# Altium schematic sheet INPUT.SchDoc: INPUT AND EMI FILTER
size 420 x 297 mm
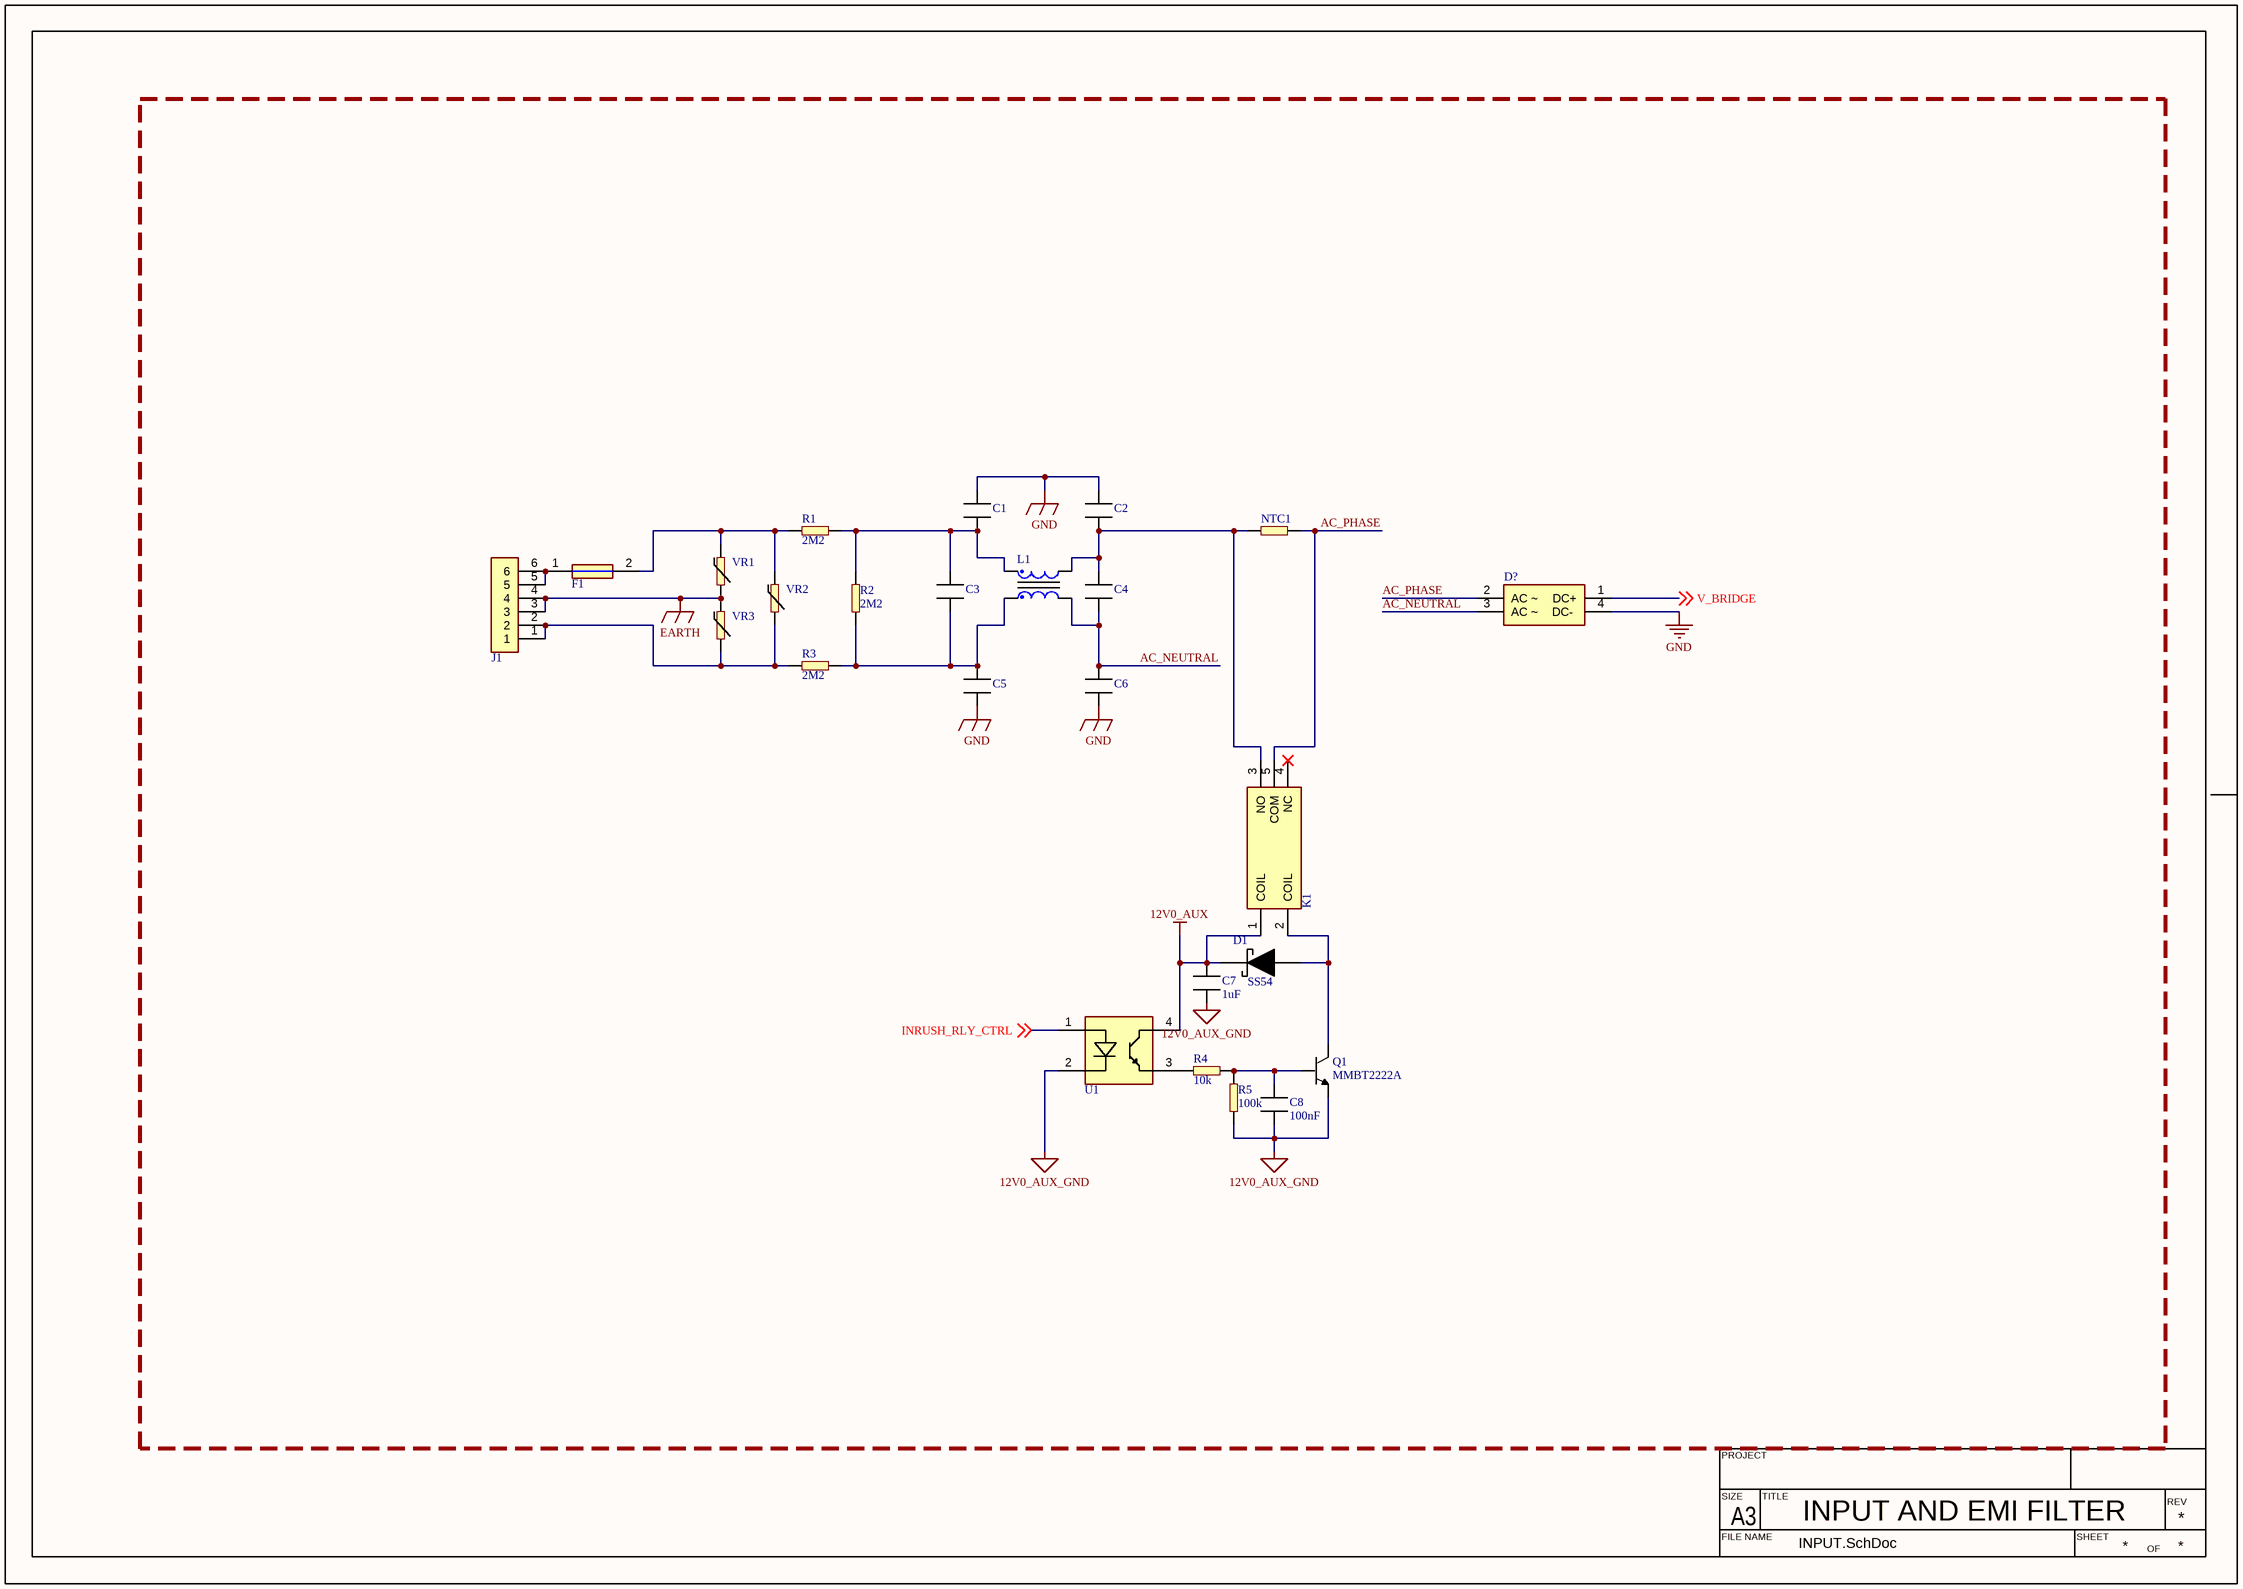
[diagram p0: INPUT.SchDoc]

## Parts
C1  VY1  [VY1222M43Y5UC63V0]  (value not drawn)
C2  VY1  [VY1222M43Y5UC63V0]  (value not drawn)
C3  B3292-X2  [B32922C3474M000]  (value not drawn)
C4  B3292-X2  [B32922C3474M000]  (value not drawn)
C5  VY1  [VY1222M43Y5UC63V0]  (value not drawn)
C6  VY1  [VY1222M43Y5UC63V0]  (value not drawn)
C7  value 1uF  [CAPC2012X13L]  (hidden comment: MLCC_0805)
C8  value 100nF  [CAPC2012X13L]  (hidden comment: MLCC_0805)
D1  value SS54  [DIOM6959X26L]  (hidden comment: ERP_104-3)
D?  PB5006-E3/45  [PB5006-E3/45]  (value not drawn)
F1  0697H  [0697H9200-02]  (value not drawn)
J1  Terminal_Block_6Pin_5.08P  [6Pin_TerminalBlock_5.08P]  (value not drawn)
K1  T9AV1L12-12  [T9AV1L12-12]  (value not drawn)
L1  PH9455.XXXNL  [PH9455.205NL]  (value not drawn)
NTC1  SL32 5R020-B  [SL32 5R020-B]  (value not drawn)
Q1  value MMBT2222A  [MMBT2222]  (hidden comment: ERP_105-1)
R1  value 2M2  [RESC3115X06N]  (hidden comment: ERP_101-1)
R2  value 2M2  [RESC3115X06N]  (hidden comment: ERP_101-1)
R3  value 2M2  [RESC3115X06N]  (hidden comment: ERP_101-1)
R4  value 10k  [RESC3115X06N]  (hidden comment: ERP_101-1)
R5  value 100k  [RESC3115X06N]  (hidden comment: ERP_101-1)
U1  FOD817A3SD  [FOD817A3SD]  (value not drawn)
VR1  B722  [B72214S0301K101]  (value not drawn)
VR2  B722  [B72214S0301K101]  (value not drawn)
VR3  B722  [B72214S0301K101]  (value not drawn)

## Nets
12V0_AUX: C7.2 D1.1(C) K1.1(COIL) U1.4(COLLECTOR)
12V0_AUX_GND: C7.1 C8.2 Q1.2 R5.2 U1.2(CATHODE)
EARTH: J1.3 J1.4 VR1.2 VR3.1
GND: C1.2 C2.2 C5.1 C6.1 D?.4(DC-)
AC_NEUTRAL: C4.1 C6.2 D?.3(AC_~) L1.4
AC_PHASE: D?.2(AC_~) K1.5(COM) NTC1.1
INRUSH_RLY_CTRL: U1.1(ANODE) ; off-sheet INRUSH_RLY_CTRL
V_BRIDGE: D?.1(DC+) ; off-sheet V_BRIDGE
NetC1_1: C1.1 C3.2 L1.2 R1.1 R2.1
NetC2_1: C2.1 C4.2 K1.3(NO) L1.3 NTC1.2
NetC3_1: C3.1 C5.2 L1.1 R2.2 R3.1
NetC8_1: C8.1 Q1.1 R4.1 R5.1
NetD1_2: D1.2(A) K1.2(COIL) Q1.3
NetF1_1: F1.1 J1.5 J1.6
NetF1_2: F1.2 R1.2 VR1.1 VR2.1
NetJ1_1: J1.1 J1.2 R3.2 VR2.2 VR3.2
NetR4_2: R4.2 U1.3(EMITTER)

Not connected (* = marked no-connect by the designer): K1 4(NC)*

## Notes on the sheet
- PROJECT
- SIZE
- FILE NAME
- A3
- TITLE
- SHEET
- OF
- REV

## Library data of the parts
C1 C2 C5 C6 = VY1: Ceramic Capacitor Y5U (E) Radial, Disc; Manufacturer 1: *; Manufacturer Part Number 1: VY1222M43Y5UC63V0; Value: *
C3 C4 = B3292-X2: Film Capacitor Polypropylene (PP); Manufacturer 1: *; Manufacturer Part Number 1: B32922C3474M000; Value: *
C7 C8 = MLCC_0805: Chip Capacitor, 2-Leads, Body 2.00x1.25mm, IPC High Density; Package: 0805; Manufacturer 1: *; Manufacturer Part Number 1: *
D1 = SS54: Supplier Part Number 1: *; Supplier  1: *; Package: SMC; Manufacturer Part Number 1: *; Manufacturer 1: *; ERP: *
D? = PB5006-E3/45: Bridge Rectifier Single Phase Standard 600 V Through Hole isoCINK+™ PB; Manufacturer Part Number 1: PB5006-E3/45; Manufacturer 1: *; Value: *
F1 = 0697H: Fuse Board Mount (Cartridge Style Excluded) Through Hole Radial, Box; Manufacturer 1: Bel Fuse Inc.; Manufacturer Part Number 1: 0697H9200-02; Value: *
J1 = Terminal_Block_6Pin_5.08P: 6PINS TERMINAL BLOCK 5.08 PITCH; Manufacturer Part Number 1: *; Manufacturer 1: *; Supplier Part Number 1: *; Supplier 1: *; ERP: *; Package: 6PIN
K1 = T9AV1L12-12: General Purpose Relay SPST-NO (1 Form A) 12VDC Coil Through Hole; Value: *; Manufacturer Part Number 1: T9AV1L12-12; Manufacturer 1: *
L1 = PH9455.XXXNL: Common Mode Choke Through Hole; Manufacturer 1: Pulse Electronics; Value: PH9455.205NL; Manufacturer Part Number 1: PH9455.205NL
NTC1 = SL32 5R020-B: Inrush Current Limiter 5 Ohms ±20% 20 A 1.220" (31.00mm); Package: *; Manufacturer 1: *; Manufacturer Part Number 1: SL32 5R020-B; Value: *
Q1 = MMBT2222: MMBT2222A; ERP: *; Suuplier Part Number 1: *; Supplier 1: *; Manufacturer Part Number 1: *; Manufacturer 1: *; Package: SOT23
R1-R5 = RES_1206: RES_0805; Package: 1206; Manufacturer 1: *; Manufacturer Part Number 1: *
U1 = FOD817A3SD: OPTOISOLATOR 5KV TRANSISTOR 4SMD; Value: *; Manufacturer: *; Manufacturer Part Number 1: *
VR1-VR3 = B722: Varistor 1 Circuit Through Hole Disc; Manufacturer 1: EPCOS - TDK Electronics; Manufacturer Part Number 1: B72214S0301K101; Value: *